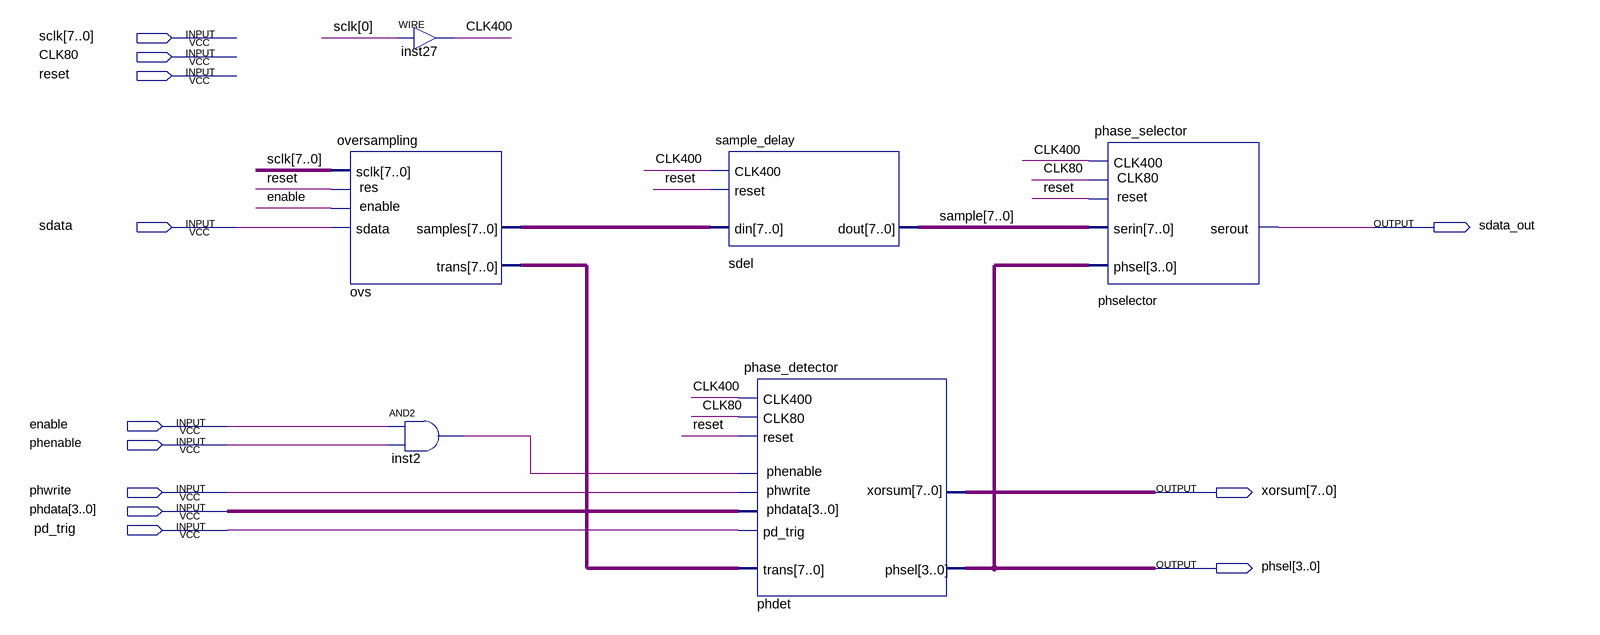
[diagram p0: schematic sheet]
// Quartus schematic cdr.bdf as structural Verilog: 6 symbols, 12 pins
module cdr (
  input  [7:0] sclk,
  input  CLK80,
  input  reset,
  input  sdata,
  input  enable,
  input  phenable,
  input  phwrite,
  input  [3:0] phdata,
  input  pd_trig,
  output sdata_out,
  output [7:0] xorsum,
  output [3:0] phsel
);

  wire CLK400, inst2_out;
  wire [7:0] ovs_samples, ovs_trans, sample;

  oversampling ovs (.sclk(sclk), .sdata(sdata), .res(reset), .enable(enable), .samples(ovs_samples), .trans(ovs_trans));
  assign CLK400 = sclk[0];  // WIRE inst27
  and inst2 (inst2_out, enable, phenable);
  sample_delay sdel (.CLK400(CLK400), .reset(reset), .din(ovs_samples), .dout(sample));
  phase_detector phdet (
    .CLK400(CLK400), .CLK80(CLK80), .trans(ovs_trans), .reset(reset), .phwrite(phwrite),
    .phenable(inst2_out), .phdata(phdata), .pd_trig(pd_trig), .xorsum(xorsum), .phsel(phsel));
  phase_selector phselector (
    .CLK400(CLK400), .serin(sample), .reset(reset), .phsel(phsel), .CLK80(CLK80), .serout(sdata_out));
endmodule
